# Altium schematic sheet RightPannel.SchDoc
size A4; SheetNumber: 2; SheetTotal: 3
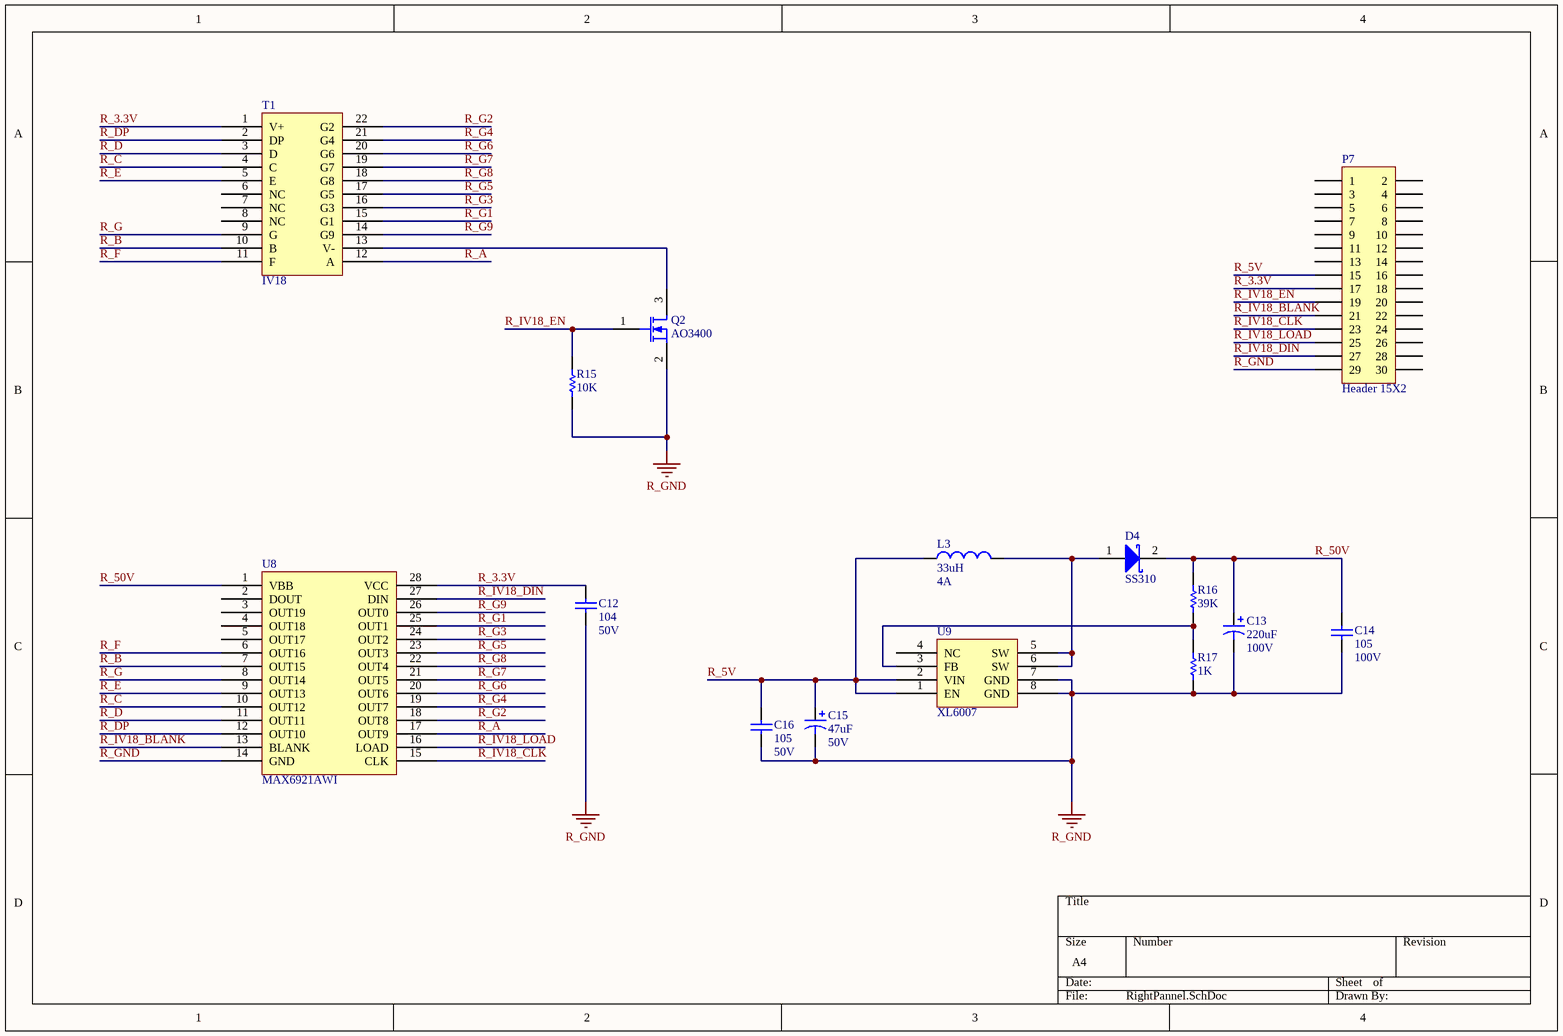
[diagram p0: RightPannel.SchDoc]

## Parts
C12  50V  value 104  [CAPC1608L]
C13  100V  value 220uF  [SMD-EC-F16]
C14  100V  value 105  [CAPC2012L]
C15  50V  value 47uF  [SMD-EC-F6.3]
C16  50V  value 105  [CAPC1608L]
D4  SS310  [DO-214AC-SMA]
L3  4A  value 33uH  [CYH125]
P7  Header 15X2  [HDR2X15]
Q2  AO3400  [SOT-23B_L]
R15  value 10K  [RESC1608L]  (hidden comment: Res1)
R16  value 39K  [RESC1608L]  (hidden comment: Res1)
R17  value 1K  [RESC1608L]  (hidden comment: Res1)
T1  IV18  [IV18]
U8  MAX6921AWI  [SOIC127P1032X265-28N]
U9  XL6007  [SOP127P780-8L]

## Nets
R_GND: C12.1 C13.2 C14.1 C15.2 C16.1 P7.29 Q2.2(S) R15.2 R17.2 U8.14(GND) U9.7(GND) U9.8(GND)
R_3.3V: C12.2 P7.17 T1.1(V+) U8.28(VCC)
R_5V: C15.1 C16.2 L3.1 P7.15 U9.1(EN) U9.2(VIN)
R_50V: C13.1 C14.2 D4.2(K) R16.1 U8.1(VBB)
R_A: T1.12(A) U8.17(OUT9)
R_B: T1.10(B) U8.7(OUT15)
R_C: T1.4(C) U8.10(OUT12)
R_D: T1.3(D) U8.11(OUT11)
R_DP: T1.2(DP) U8.12(OUT10)
R_E: T1.5(E) U8.9(OUT13)
R_F: T1.11(F) U8.6(OUT16)
R_G: T1.9(G) U8.8(OUT14)
R_G1: T1.15(G1) U8.25(OUT1)
R_G2: T1.22(G2) U8.18(OUT8)
R_G3: T1.16(G3) U8.24(OUT2)
R_G4: T1.21(G4) U8.19(OUT7)
R_G5: T1.17(G5) U8.23(OUT3)
R_G6: T1.20(G6) U8.20(OUT6)
R_G7: T1.19(G7) U8.21(OUT5)
R_G8: T1.18(G8) U8.22(OUT4)
R_G9: T1.14(G9) U8.26(OUT0)
R_IV18_BLANK: P7.21 U8.13(BLANK)
R_IV18_CLK: P7.23 U8.15(CLK)
R_IV18_DIN: P7.27 U8.27(DIN)
R_IV18_EN: P7.19 Q2.1(G) R15.1
R_IV18_LOAD: P7.25 U8.16(LOAD)
NetD4_1: D4.1(A) L3.2 U9.5(SW) U9.6(SW)
NetQ2_3: Q2.3(D) T1.13(V-)
NetR16_2: R16.2 R17.1 U9.3(FB)

Not connected (* = marked no-connect by the designer): P7 1 2 3 4 5 6 7 8 9 10 11 12 13 14 16 18 20 22 24 26 28 30; T1 6(NC) 7(NC) 8(NC); U8 2(DOUT) 3(OUT19) 4(OUT18) 5(OUT17); U9 4(NC)

## Library data of the parts
C12 C14 C16 = Cap: Capacitor; Published: 8-Jun-2000; LatestRevisionDate: 17-Jul-2002; LatestRevisionNote: Re-released for DXP Platform.; PackageReference: RAD-0.3; Publisher: Altium Limited; PackageDescription: Radial Cap, Thru-Hole; 2 Leads; 0.3 in Pin Spacing
C13 C15 = Cap Pol1: Polarized Capacitor (Radial); Published: 8-Jun-2000; LatestRevisionDate: 17-Jul-2002; LatestRevisionNote: Re-released for DXP Platform.; PackageReference: RB7.6-15; Publisher: Altium Limited; PackageDescription: Polarized Capacitor (Radial); 2 Leads
D4 = D Schottky: Schottky Diode; Published: 8-Jun-2000; LatestRevisionDate: 17-Jul-2002; LatestRevisionNote: Re-released for DXP Platform.; PackageReference: SMB; Publisher: Altium Limited; PackageDescription: DO-214-AA/SMB; 2 C-Bend Leads; Body 5.3 x 3.6 mm, inc. leads (LxW); Code_JEDEC: DO-214-AA
L3 = Inductor: Code_IEC: 1005; Published: 8-Jun-2000; LatestRevisionDate: 29-May-2009; LatestRevisionNote: IPC-7351 Footprint Added.; PackageReference: 0402-A; Publisher: Altium Limited; PackageDescription: Chip Inductor; Code_JEITA: 0402
P7 = Header 15X2: Header, 15-Pin, Dual row; LatestRevisionDate: 17-Jul-2002; LatestRevisionNote: Re-released for DXP Platform.; Publisher: Altium Limited
Q2 = MOSFET-N: N-Channel MOSFET; Published: 8-Jun-2000; LatestRevisionDate: 17-Jul-2002; LatestRevisionNote: Re-released for DXP Platform.; PackageVersion: 1995/1996; PackageReference: E3; Publisher: Altium Limited; PackageDescription: TO, Flat Index; 3 In-Line, Axial Leads; Body Dia. 4.6mm; Lead Dia. 0.5 mm (max)
R15-R17 = Res1: Resistor; Published: 8-Jun-2000; LatestRevisionDate: 17-Jul-2002; LatestRevisionNote: Re-released for DXP Platform.; PackageReference: AXIAL-0.3; Publisher: Altium Limited; PackageDescription: Axial Device, Thru-Hole; 2 Leads; 0.3 in Pin Spacing